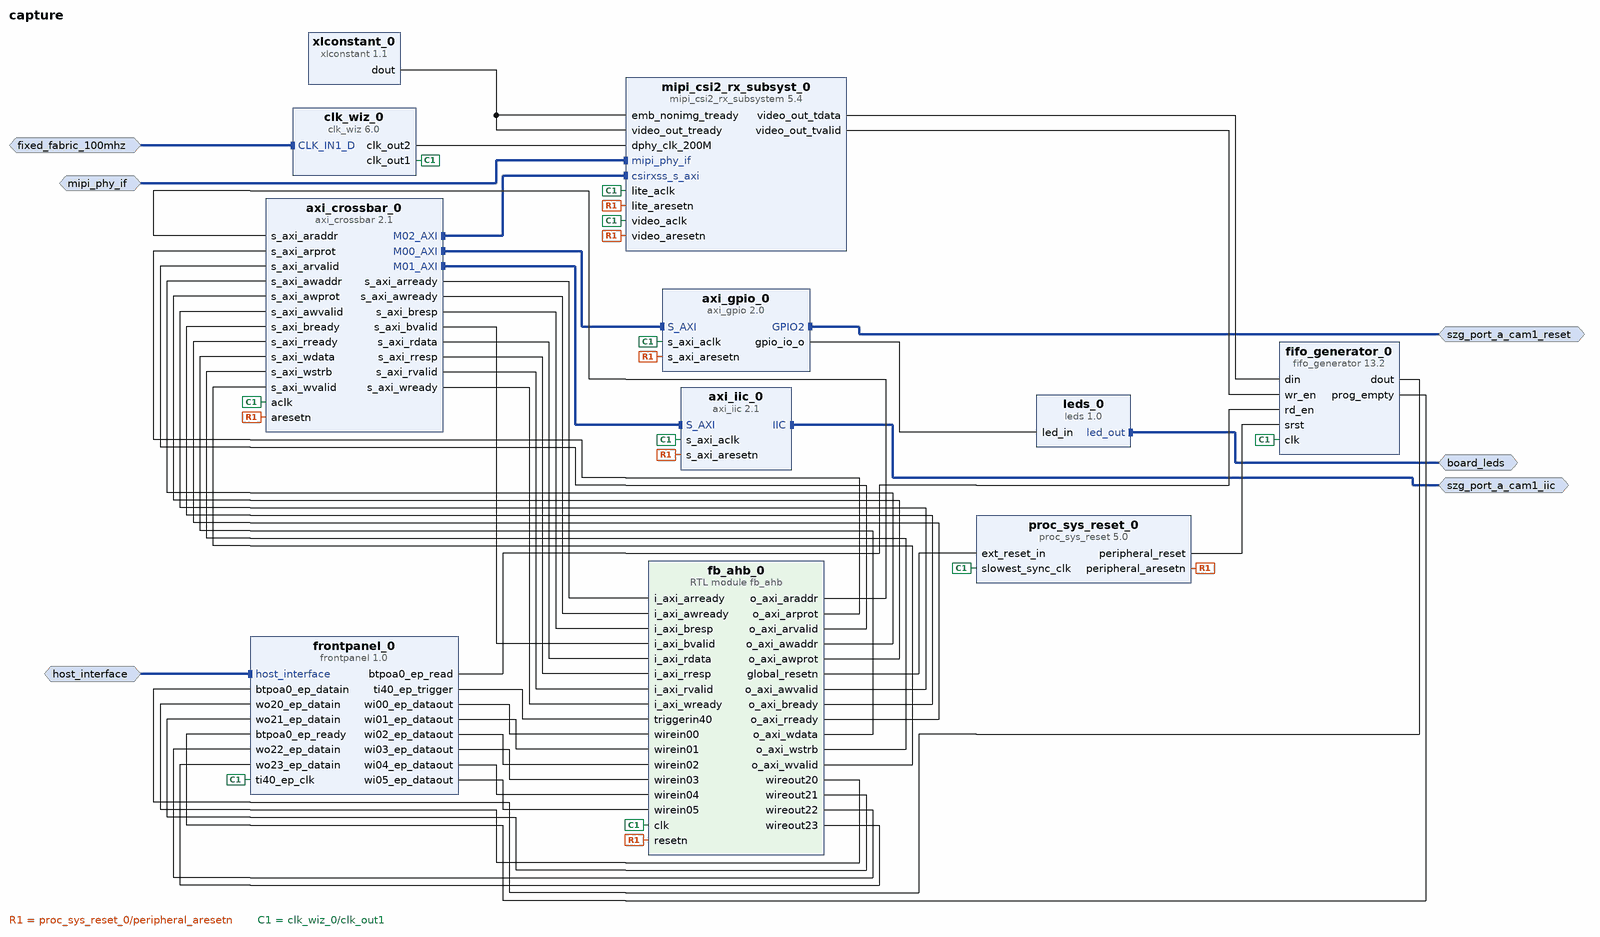
[diagram p0: block diagram of the top level]
# Vivado block design capture, xcau25p-ffvb676-2-e, Vivado 2023.2
create_bd_design capture

create_bd_intf_port -mode Slave -vlnv opalkelly.com:interface:host_interface_rtl:1.0 host_interface
create_bd_intf_port -mode Slave -vlnv xilinx.com:interface:diff_clock_rtl:1.0 fixed_fabric_100mhz
set_property -dict {CONFIG.FREQ_HZ 100000000} [get_bd_intf_ports fixed_fabric_100mhz]
create_bd_intf_port -mode Master -vlnv opalkelly.com:interface:led_rtl:1.0 board_leds
create_bd_intf_port -mode Master -vlnv xilinx.com:interface:iic_rtl:1.0 szg_port_a_cam1_iic
create_bd_intf_port -mode Slave -vlnv xilinx.com:interface:mipi_phy_rtl:1.0 mipi_phy_if
create_bd_intf_port -mode Master -vlnv xilinx.com:interface:gpio_rtl:1.0 szg_port_a_cam1_reset

create_bd_cell -type ip -vlnv opalkelly.com:ip:frontpanel:1.0 frontpanel_0
set_property -dict [list \
  CONFIG.BTPO.ADDR_0 0xa0 \
  CONFIG.BTPO.COUNT 1 \
  CONFIG.RB.EN false \
  CONFIG.TI.ADDR_0 0x40 \
  CONFIG.TI.COUNT 1 \
  CONFIG.TO.ADDR_0 0xff \
  CONFIG.TO.ADDR_1 0xff \
  CONFIG.TO.COUNT 0 \
  CONFIG.WI.ADDR_0 0x00 \
  CONFIG.WI.ADDR_1 0x01 \
  CONFIG.WI.ADDR_2 0x02 \
  CONFIG.WI.ADDR_3 0x03 \
  CONFIG.WI.ADDR_4 0x04 \
  CONFIG.WI.ADDR_5 0x05 \
  CONFIG.WI.COUNT 6 \
  CONFIG.WO.ADDR_0 0x20 \
  CONFIG.WO.ADDR_1 0x21 \
  CONFIG.WO.ADDR_2 0x22 \
  CONFIG.WO.ADDR_3 0x23 \
  CONFIG.WO.ADDR_4 0xff \
  CONFIG.WO.COUNT 4 \
  CONFIG.host_interface_BOARD_INTERFACE host_interface \
] [get_bd_cells frontpanel_0]
create_bd_cell -type ip -vlnv xilinx.com:ip:clk_wiz:6.0 clk_wiz_0
set_property -dict [list \
  CONFIG.AUTO_PRIMITIVE PLL \
  CONFIG.CLKOUT1_DRIVES Buffer \
  CONFIG.CLKOUT1_JITTER 144.719 \
  CONFIG.CLKOUT1_PHASE_ERROR 114.212 \
  CONFIG.CLKOUT2_DRIVES Buffer \
  CONFIG.CLKOUT2_JITTER 126.455 \
  CONFIG.CLKOUT2_PHASE_ERROR 114.212 \
  CONFIG.CLKOUT2_REQUESTED_OUT_FREQ 200.000 \
  CONFIG.CLKOUT2_USED true \
  CONFIG.CLKOUT3_DRIVES Buffer \
  CONFIG.CLKOUT4_DRIVES Buffer \
  CONFIG.CLKOUT5_DRIVES Buffer \
  CONFIG.CLKOUT6_DRIVES Buffer \
  CONFIG.CLKOUT7_DRIVES Buffer \
  CONFIG.CLK_IN1_BOARD_INTERFACE fixed_fabric_100mhz \
  CONFIG.FEEDBACK_SOURCE FDBK_AUTO \
  CONFIG.MMCM_BANDWIDTH OPTIMIZED \
  CONFIG.MMCM_CLKFBOUT_MULT_F 8 \
  CONFIG.MMCM_CLKOUT0_DIVIDE_F 8 \
  CONFIG.MMCM_CLKOUT1_DIVIDE 4 \
  CONFIG.MMCM_COMPENSATION AUTO \
  CONFIG.NUM_OUT_CLKS 2 \
  CONFIG.OPTIMIZE_CLOCKING_STRUCTURE_EN true \
  CONFIG.PRIMITIVE Auto \
  CONFIG.PRIM_SOURCE Differential_clock_capable_pin \
  CONFIG.USE_BOARD_FLOW true \
  CONFIG.USE_LOCKED false \
  CONFIG.USE_RESET false \
] [get_bd_cells clk_wiz_0]
create_bd_cell -type ip -vlnv xilinx.com:ip:proc_sys_reset:5.0 proc_sys_reset_0
create_bd_cell -type module -reference fb_ahb fb_ahb_0
create_bd_cell -type ip -vlnv xilinx.com:ip:axi_crossbar:2.1 axi_crossbar_0
set_property -dict [list \
  CONFIG.ADDR_RANGES 1 \
  CONFIG.M00_A00_ADDR_WIDTH 12 \
  CONFIG.M00_A00_BASE_ADDR 0x0000000000100000 \
  CONFIG.M01_A00_ADDR_WIDTH 12 \
  CONFIG.M01_A00_BASE_ADDR 0x0000000000200000 \
  CONFIG.M02_A00_ADDR_WIDTH 16 \
  CONFIG.M02_A00_BASE_ADDR 0x0000000000300000 \
  CONFIG.NUM_MI 3 \
  CONFIG.STRATEGY 0 \
] [get_bd_cells axi_crossbar_0]
create_bd_cell -type ip -vlnv xilinx.com:ip:axi_gpio:2.0 axi_gpio_0
set_property -dict [list \
  CONFIG.C_ALL_OUTPUTS 1 \
  CONFIG.C_GPIO_WIDTH 6 \
  CONFIG.GPIO2_BOARD_INTERFACE szg_port_a_cam1_reset \
  CONFIG.USE_BOARD_FLOW true \
] [get_bd_cells axi_gpio_0]
create_bd_cell -type ip -vlnv xilinx.com:ip:axi_iic:2.1 axi_iic_0
set_property -dict [list \
  CONFIG.C_SCL_INERTIAL_DELAY 3 \
  CONFIG.C_SDA_INERTIAL_DELAY 3 \
  CONFIG.C_SDA_LEVEL 1 \
  CONFIG.IIC_BOARD_INTERFACE szg_port_a_cam1_iic \
  CONFIG.USE_BOARD_FLOW true \
] [get_bd_cells axi_iic_0]
create_bd_cell -type ip -vlnv opalkelly.com:ip:leds:1.0 leds_0
set_property -dict {CONFIG.LED_OUT_BOARD_INTERFACE board_leds} [get_bd_cells leds_0]
create_bd_cell -type ip -vlnv xilinx.com:ip:mipi_csi2_rx_subsystem:5.4 mipi_csi2_rx_subsyst_0
set_property -dict [list \
  CONFIG.CMN_INC_VFB true \
  CONFIG.CMN_NUM_LANES 2 \
  CONFIG.CMN_NUM_PIXELS 4 \
  CONFIG.CMN_PXL_FORMAT RAW8 \
  CONFIG.CSI_BUF_DEPTH 16384 \
  CONFIG.CSI_EMB_NON_IMG true \
  CONFIG.C_CSI_EN_ACTIVELANES true \
  CONFIG.C_CSI_EN_CRC true \
  CONFIG.C_CSI_FILTER_USERDATATYPE true \
  CONFIG.C_EN_CSI_V2_0 false \
  CONFIG.C_EN_TIMEOUT_REGS true \
  CONFIG.DPHYRX_BOARD_INTERFACE szg_port_a_rxcsi_cam1 \
  CONFIG.DPY_EN_REG_IF true \
  CONFIG.DPY_LINE_RATE 800 \
  CONFIG.SupportLevel 1 \
  CONFIG.VFB_TU_WIDTH 32 \
] [get_bd_cells mipi_csi2_rx_subsyst_0]
create_bd_cell -type ip -vlnv xilinx.com:ip:fifo_generator:13.2 fifo_generator_0
set_property -dict [list \
  CONFIG.Empty_Threshold_Assert_Value 1024 \
  CONFIG.Input_Data_Width 32 \
  CONFIG.Input_Depth 65536 \
  CONFIG.Overflow_Flag true \
  CONFIG.Programmable_Empty_Type Single_Programmable_Empty_Threshold_Constant \
] [get_bd_cells fifo_generator_0]
create_bd_cell -type ip -vlnv xilinx.com:ip:xlconstant:1.1 xlconstant_0
set_property -dict {CONFIG.CONST_WIDTH 1} [get_bd_cells xlconstant_0]

# ---- connections ----

connect_bd_intf_net [get_bd_intf_pins axi_gpio_0/S_AXI] [get_bd_intf_pins axi_crossbar_0/M00_AXI]
connect_bd_intf_net [get_bd_intf_pins axi_iic_0/S_AXI] [get_bd_intf_pins axi_crossbar_0/M01_AXI]
connect_bd_intf_net [get_bd_intf_pins mipi_csi2_rx_subsyst_0/csirxss_s_axi] [get_bd_intf_pins axi_crossbar_0/M02_AXI]
connect_bd_intf_net [get_bd_intf_ports szg_port_a_cam1_reset] [get_bd_intf_pins axi_gpio_0/GPIO2]
connect_bd_intf_net [get_bd_intf_ports szg_port_a_cam1_iic] [get_bd_intf_pins axi_iic_0/IIC]
connect_bd_intf_net [get_bd_intf_ports fixed_fabric_100mhz] [get_bd_intf_pins clk_wiz_0/CLK_IN1_D]
connect_bd_intf_net [get_bd_intf_ports host_interface] [get_bd_intf_pins frontpanel_0/host_interface]
connect_bd_intf_net [get_bd_intf_ports board_leds] [get_bd_intf_pins leds_0/led_out]
connect_bd_intf_net [get_bd_intf_pins mipi_csi2_rx_subsyst_0/mipi_phy_if] [get_bd_intf_ports mipi_phy_if]
connect_bd_net [get_bd_pins fifo_generator_0/dout] [get_bd_pins frontpanel_0/btpoa0_ep_datain]
connect_bd_net [get_bd_pins xlconstant_0/dout] \
  [get_bd_pins mipi_csi2_rx_subsyst_0/video_out_tready] [get_bd_pins mipi_csi2_rx_subsyst_0/emb_nonimg_tready]
connect_bd_net [get_bd_pins axi_crossbar_0/s_axi_arready] [get_bd_pins fb_ahb_0/i_axi_arready]
connect_bd_net [get_bd_pins axi_crossbar_0/s_axi_awready] [get_bd_pins fb_ahb_0/i_axi_awready]
connect_bd_net [get_bd_pins axi_crossbar_0/s_axi_bresp] [get_bd_pins fb_ahb_0/i_axi_bresp]
connect_bd_net [get_bd_pins axi_crossbar_0/s_axi_bvalid] [get_bd_pins fb_ahb_0/i_axi_bvalid]
connect_bd_net [get_bd_pins axi_crossbar_0/s_axi_rdata] [get_bd_pins fb_ahb_0/i_axi_rdata]
connect_bd_net [get_bd_pins axi_crossbar_0/s_axi_rresp] [get_bd_pins fb_ahb_0/i_axi_rresp]
connect_bd_net [get_bd_pins axi_crossbar_0/s_axi_rvalid] [get_bd_pins fb_ahb_0/i_axi_rvalid]
connect_bd_net [get_bd_pins axi_crossbar_0/s_axi_wready] [get_bd_pins fb_ahb_0/i_axi_wready]
connect_bd_net [get_bd_pins axi_gpio_0/gpio_io_o] [get_bd_pins leds_0/led_in]
connect_bd_net [get_bd_pins clk_wiz_0/clk_out2] [get_bd_pins mipi_csi2_rx_subsyst_0/dphy_clk_200M]
connect_bd_net -net fb_ahb_0_global_resetn [get_bd_pins proc_sys_reset_0/peripheral_aresetn] \
  [get_bd_pins axi_crossbar_0/aresetn] [get_bd_pins axi_gpio_0/s_axi_aresetn] [get_bd_pins axi_iic_0/s_axi_aresetn] \
  [get_bd_pins fb_ahb_0/resetn] [get_bd_pins mipi_csi2_rx_subsyst_0/lite_aresetn] \
  [get_bd_pins mipi_csi2_rx_subsyst_0/video_aresetn]
connect_bd_net [get_bd_pins fb_ahb_0/global_resetn] [get_bd_pins proc_sys_reset_0/ext_reset_in]
connect_bd_net [get_bd_pins fb_ahb_0/o_axi_araddr] [get_bd_pins axi_crossbar_0/s_axi_araddr]
connect_bd_net [get_bd_pins fb_ahb_0/o_axi_arprot] [get_bd_pins axi_crossbar_0/s_axi_arprot]
connect_bd_net [get_bd_pins fb_ahb_0/o_axi_arvalid] [get_bd_pins axi_crossbar_0/s_axi_arvalid]
connect_bd_net [get_bd_pins fb_ahb_0/o_axi_awaddr] [get_bd_pins axi_crossbar_0/s_axi_awaddr]
connect_bd_net [get_bd_pins fb_ahb_0/o_axi_awprot] [get_bd_pins axi_crossbar_0/s_axi_awprot]
connect_bd_net [get_bd_pins fb_ahb_0/o_axi_awvalid] [get_bd_pins axi_crossbar_0/s_axi_awvalid]
connect_bd_net [get_bd_pins fb_ahb_0/o_axi_bready] [get_bd_pins axi_crossbar_0/s_axi_bready]
connect_bd_net [get_bd_pins fb_ahb_0/o_axi_rready] [get_bd_pins axi_crossbar_0/s_axi_rready]
connect_bd_net [get_bd_pins fb_ahb_0/o_axi_wdata] [get_bd_pins axi_crossbar_0/s_axi_wdata]
connect_bd_net [get_bd_pins fb_ahb_0/o_axi_wstrb] [get_bd_pins axi_crossbar_0/s_axi_wstrb]
connect_bd_net [get_bd_pins fb_ahb_0/o_axi_wvalid] [get_bd_pins axi_crossbar_0/s_axi_wvalid]
connect_bd_net [get_bd_pins fb_ahb_0/wireout20] [get_bd_pins frontpanel_0/wo20_ep_datain]
connect_bd_net [get_bd_pins fb_ahb_0/wireout21] [get_bd_pins frontpanel_0/wo21_ep_datain]
connect_bd_net [get_bd_pins fb_ahb_0/wireout22] [get_bd_pins frontpanel_0/wo22_ep_datain]
connect_bd_net [get_bd_pins fb_ahb_0/wireout23] [get_bd_pins frontpanel_0/wo23_ep_datain]
connect_bd_net [get_bd_pins fifo_generator_0/prog_empty] [get_bd_pins frontpanel_0/btpoa0_ep_ready]
connect_bd_net [get_bd_pins frontpanel_0/btpoa0_ep_read] [get_bd_pins fifo_generator_0/rd_en]
connect_bd_net -net frontpanel_0_okClk [get_bd_pins clk_wiz_0/clk_out1] \
  [get_bd_pins frontpanel_0/ti40_ep_clk] [get_bd_pins proc_sys_reset_0/slowest_sync_clk] [get_bd_pins axi_crossbar_0/aclk] \
  [get_bd_pins axi_gpio_0/s_axi_aclk] [get_bd_pins axi_iic_0/s_axi_aclk] [get_bd_pins fb_ahb_0/clk] \
  [get_bd_pins mipi_csi2_rx_subsyst_0/lite_aclk] [get_bd_pins mipi_csi2_rx_subsyst_0/video_aclk] \
  [get_bd_pins fifo_generator_0/clk]
connect_bd_net [get_bd_pins frontpanel_0/ti40_ep_trigger] [get_bd_pins fb_ahb_0/triggerin40]
connect_bd_net [get_bd_pins frontpanel_0/wi00_ep_dataout] [get_bd_pins fb_ahb_0/wirein00]
connect_bd_net [get_bd_pins frontpanel_0/wi01_ep_dataout] [get_bd_pins fb_ahb_0/wirein01]
connect_bd_net [get_bd_pins frontpanel_0/wi02_ep_dataout] [get_bd_pins fb_ahb_0/wirein02]
connect_bd_net [get_bd_pins frontpanel_0/wi03_ep_dataout] [get_bd_pins fb_ahb_0/wirein03]
connect_bd_net [get_bd_pins frontpanel_0/wi04_ep_dataout] [get_bd_pins fb_ahb_0/wirein04]
connect_bd_net [get_bd_pins frontpanel_0/wi05_ep_dataout] [get_bd_pins fb_ahb_0/wirein05]
connect_bd_net [get_bd_pins mipi_csi2_rx_subsyst_0/video_out_tdata] [get_bd_pins fifo_generator_0/din]
connect_bd_net [get_bd_pins mipi_csi2_rx_subsyst_0/video_out_tvalid] [get_bd_pins fifo_generator_0/wr_en]
connect_bd_net [get_bd_pins proc_sys_reset_0/peripheral_reset] [get_bd_pins fifo_generator_0/srst]

validate_bd_design
save_bd_design
